# Altium schematic sheet 3V3_REG.SchDoc
size B; SheetNumber: 12; SheetTotal: 17
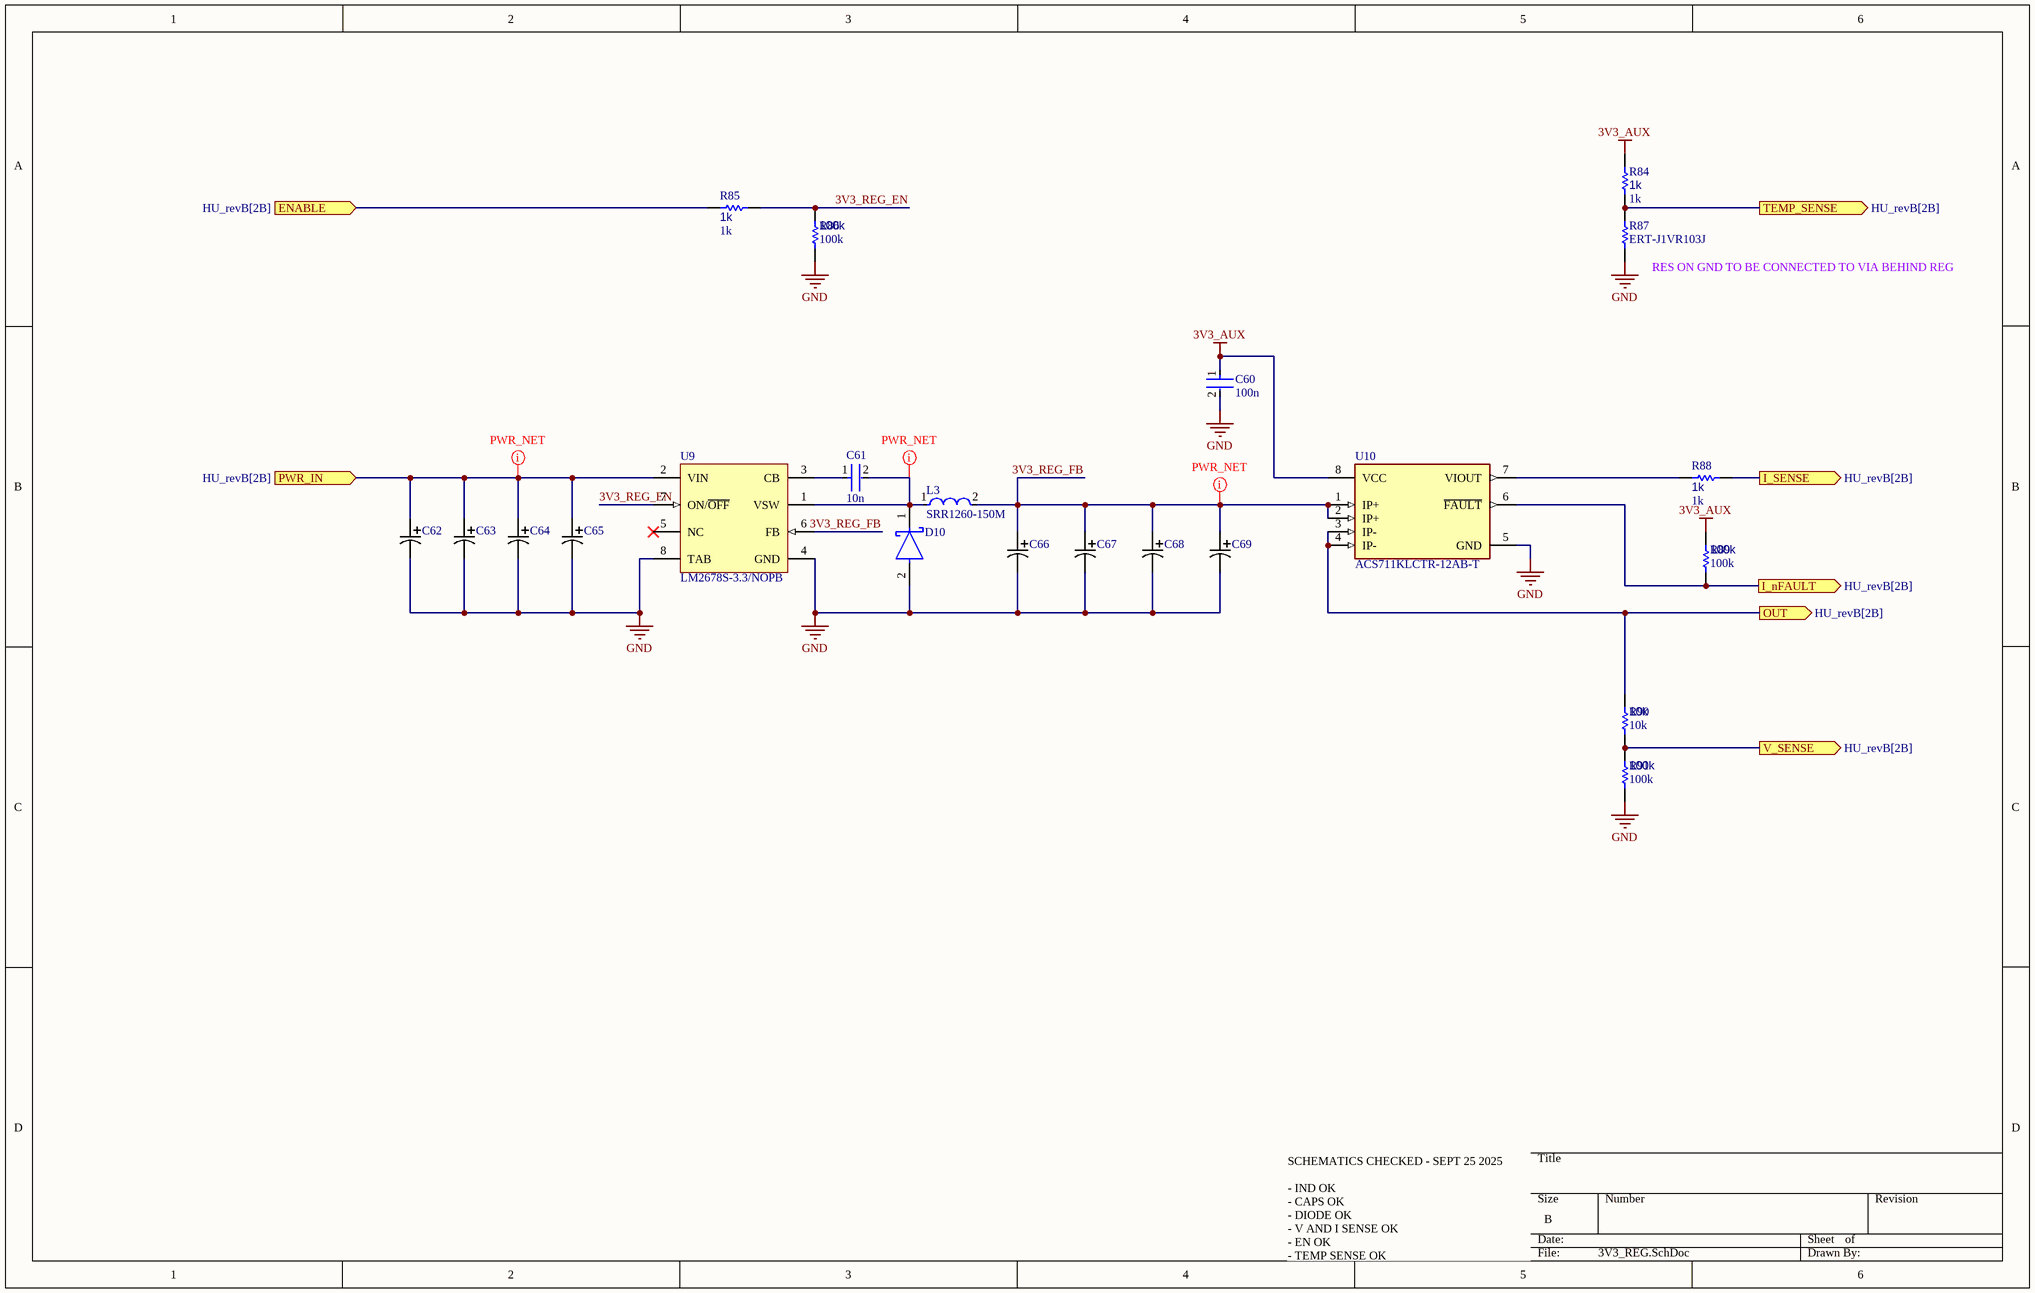
[diagram p0: 3V3_REG.SchDoc]

## Parts
C60  100n  [FP-0402-L_1_0_0_05-W_0_5-IPC_A]
C61  10n  [FP-0402-L_1_0_0_05-W_0_5-IPC_A]
C62  T495D475K050ATE300  [T495D475K050ATE300-Footprint-1]  (value not drawn)
C63  T495D475K050ATE300  [T495D475K050ATE300-Footprint-1]  (value not drawn)
C64  T495D475K050ATE300  [T495D475K050ATE300-Footprint-1]  (value not drawn)
C65  T495D475K050ATE300  [T495D475K050ATE300-Footprint-1]  (value not drawn)
C66  T495D337K010ATE150  [T495D337K010ATE150-Footprint-1]  (value not drawn)
C67  T495D337K010ATE150  [T495D337K010ATE150-Footprint-1]  (value not drawn)
C68  T495D337K010ATE150  [T495D337K010ATE150-Footprint-1]  (value not drawn)
C69  T495D337K010ATE150  [T495D337K010ATE150-Footprint-1]  (value not drawn)
D10  B540C-13-F  [FP-SMC-MFG]  (value not drawn)
L3  SRR1260-150M  [FP-SRR1260-MFG]
R84  1k  [R0603B]
R85  1k  [R0603B]
R86  100k  [R0603B]
R87  ERT-J1VR103J  [RESC1608X90X30ML15T20]
R88  1k  [R0603B]
R89  100k  [R0603B]
R90  10k  [R0603B]
R91  100k  [R0603B]
U9  LM2678S-3.3/NOPB  [KTW0007B_N]
U10  ACS711KLCTR-12AB-T  [FP-LC-8-IPC_C]

## Ports
ENABLE (in, see HU_revB[2B]), I_nFAULT (out, see HU_revB[2B]), I_SENSE (out, see HU_revB[2B]), OUT (out, see HU_revB[2B]), PWR_IN (in, see HU_revB[2B]), TEMP_SENSE (out, see HU_revB[2B]), V_SENSE (out, see HU_revB[2B])

## Nets
3V3_AUX: C60.1 R84.1 R89.2 U10.8(VCC)
GND: C60.2 C62.2 C63.2 C64.2 C65.2 C66.2 C67.2 C68.2 C69.2 D10.2(A) R86.1 R87.1 R91.1 U9.4(GND) U9.8(TAB) U10.5(GND)
3V3_REG_EN: R85.1 R86.2 U9.7(ON/~{OFF})
3V3_REG_FB: C66.1 C67.1 C68.1 C69.1 L3.2 U9.6(FB) U10.1(IP+) U10.2(IP+)
ENABLE: R85.2 ; port ENABLE
I_nFAULT: R89.1 U10.6(~{FAULT}) ; port I_nFAULT
I_SENSE: R88.1 ; port I_SENSE
OUT: R90.2 U10.3(IP-) U10.4(IP-) ; port OUT
PWR_IN: C62.1 C63.1 C64.1 C65.1 U9.2(VIN) ; port PWR_IN
TEMP_SENSE: R84.2 R87.2 ; port TEMP_SENSE
V_SENSE: R90.1 R91.2 ; port V_SENSE
NetC61_1: C61.1 U9.3(CB)
NetC61_2: C61.2 D10.1(C) L3.1 U9.1(VSW)
NetR88_2: R88.2 U10.7(VIOUT)

Not connected (* = marked no-connect by the designer): U9 5(NC)*

## Layout directives
net class PWR: 3V3_REG_FB, NetC61_2, PWR_IN

## Notes on the sheet
- (near R87) RES ON GND TO BE CONNECTED TO VIA BEHIND REG
- SCHEMATICS CHECKED - SEPT 25 2025
  - IND OK
  - CAPS OK
  - DIODE OK
  - V AND I SENSE OK
  - EN OK
  - TEMP SENSE OK

## Library data of the parts
C60 C61 = CMP-001-00058-1: LARGE PADS, 0402 CAP, CHANGE COMMENT TO MATCH REAL P/N; Capacitor Type: Ceramic; Min Operating Temperature: -55°C; Mounting Technology: Surface Mount; Pins: 2; Case/Package: 0402; RoHS Compliant: Yes; Max Operating Temperature: 85°C
C62-C65 = CMP-001-00066-1: Cap Tant Solid 4.7uF 50V D CASE 10% (7.3 X 4.3 X 2.8mm) SMD 7343-31 0.3 Ohm 125 C T/R; Value: 4.7µF; Min Operating Temperature: -55°C; Voltage Rating: 50V; Tolerance: 10%; Mounting Technology: Surface Mount; Max Operating Temperature: 125°C; Case/Package: 7343-31; Pins: 2
C66-C69 = CMP-001-00067-1: 330uF Solid MnO2 Tantalum Capacitor, 10 V dc +/-10%, T495 Series; Tolerance: 10%; Voltage Rating: 10V; Value: 330µF; Case/Package: 2917; Min Operating Temperature: -55°C; Mounting Technology: Surface Mount; Max Operating Temperature: 125°C
D10 = CMP-2000-05097-3: DIODE SCHOTTKY 40V 5A SMC; Manufacturer: Diodes Inc.; Automotive Grade: NA; Peak Reverse Current: 0.5mA; Value: 300pF; Max Junction Temp: +150°C; Max Surge Forward Current: 100A; Standoff Height: 0.1mm; Digikey Description: DIODE SCHOTTKY 40V 5A SMC; Temperature Range Low: -55°C; Manufacturer Part Number: B540C-13-F; Octopart: https://octopart.com/b540c-13-f-diodes+inc.-325873; Lead Free: Yes; Reverse Voltage: 40V; RoHS: TRUE; Category: Diode; Mouser Description: Diode: Schottky rectifying; SMD; 40V; 5A; SMC; Package: reel, tape; ComponentLink2Description: Datasheet; Temperature Range High: +150°C; Automotive: No; Footprint Url: https://www.diodes.com/assets/Package-Files/SMC.pdf; Device Class L3: Schottky Diodes; Height: 2.5mm; Forward Current: 5A; Temperature: -55°C to +150°C; Package: SMC; ComponentLink2URL: https://www.diodes.com/assets/Datasheets/ds13012.pdf; Device Class L2: Diodes; Max Repetitive Reverse Voltage: 40V; Device Class L1: Discrete Semiconductors; Capacitance: 300pF
L3 = CMP-2000-07146-2: FIXED IND 15UH 5A 27 MOHM SMD; Q Factor: 25; Sample Rate (Hz): 100kHz; Resistance: 27MR; Material: Steel; Inductance Tolerance: 20%; Frequency: 17.6MHz; Saturation Current: 4.6A; Core Material: Ferrite; Shielding: Shielded; Series: SRR1260; Termination: SMD/SMT; Packaging: Tape and Reel; RoHS Compliant: Yes; Height - Seated (Max): 0.256inch; Depth: 12.8mm; Case/Package: 1260; Inductance: 15uH; Height: 6mm; Number of Pins: 2; Mount: Surface Mount; Min Operating Temperature: -40°C; Test Frequency: 100kHz; Length: 12.5mm; Self Resonant Frequency: 17.6MHz; Current Rating: 5A; Tolerance: 20%; RMS Current (Irms): 5A; REACH SVHC: No SVHC; Resistor Type: Wirewound; DC Resistance (DCR): 27mR; Width: 12.5mm; Package Quantity: 600; DC Current: 5A; Max DC Current: 5A; Max Operating Temperature: 125°C; Military Standard: Not
R84-R86 R88-R91 = CMP-009-00002-14: Resistor
  R84 R85 R88: Value: 1k
  R86 R89 R91: Value: 100k
  R90: Value: 10k
R87 = CMP-2000-00869-1: Manufacturer: Panasonic; Part Number: ERT-J1VR103J
U9 = CMP-0069-00195-3: SIMPLE SWITCHER® High Efficiency 5A Step-Down Voltage Regulator, 7-pin TO-263, Pb-Free; Manufacturer: Texas Instruments; PackageTopMarking: NSUZXYTTE#*LM2678*S-3.3; PowerWise: N; PackageReference: KTW0007B; Code_JEDEC: MO-169-AC; CompType: Switcher; RoHS: Y; PackageDescription: TO-263, Molded, .400 x .390 x .180in Body, 7 Lead, .050in Pitch, Surface Mount; ComponentLink1Description: Datasheet URL; PinCount: 7; ComponentLink1URL: http://www.ti.com/general/docs/lit/getliterature.tsp?genericPartNumber=LM2678&fileType=pdf
U10 = CMP-1557-00012-2: SENSOR CURRENT HALL 12.5A AC/DC; Number of Channels: 1; Min Supply Voltage: 3V; Sensitivity: 110mV/A; Response Time: 4.6us; Operating Supply Voltage: 3.3V; Max Supply Voltage: 5.5V; Max Supply Current: 5.5mA; Bandwidth: 100kHz; Linearity: 1%; Quiescent Current: 4mA; Accuracy: 5%; Polarity: Bidirectional; Case/Package: SOIC; Packaging: Tape and Reel; Number of Pins: 8; Width: 3.9mm; Frequency: 100kHz; -3db Bandwidth: 100kHz; REACH SVHC: No SVHC; Series: -; Height: 1.5mm; Package Quantity: 1; Min Operating Temperature: -40°C; Max Operating Temperature: 125°C; Current Sensing: 12.5A; RoHS Compliant: Yes; Length: 4.9mm